# Altium schematic sheet dcdc_conv.SchDoc
size A
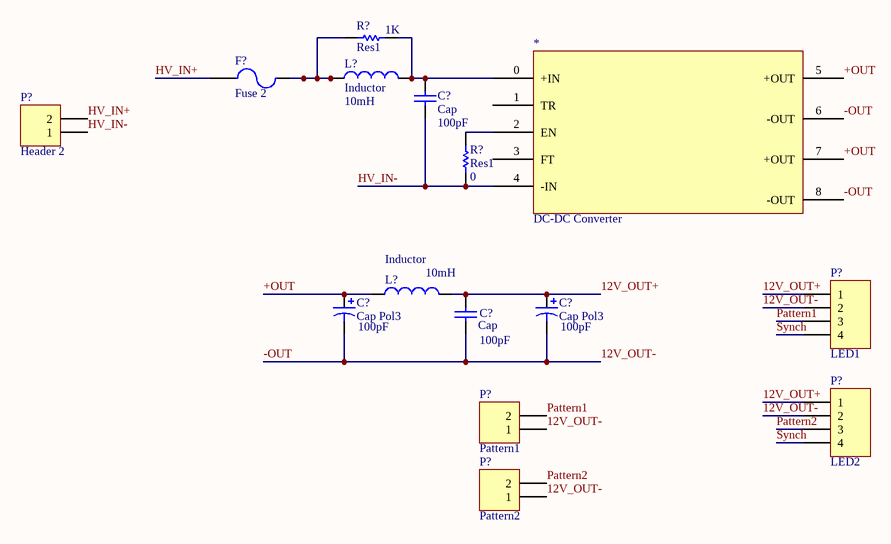
[diagram p0: dcdc_conv.SchDoc]

## Parts
(Parts that share a designator on the sheet are numbered #1, #2 ... from top to bottom, then left to right.)
*  DC-DC Converter
C?#1  Cap  value 100pF  [RAD-0.3]
C?#2  Cap Pol3  value 100pF  [C0805]
C?#3  Cap Pol3  value 100pF  [C0805]
C?#4  Cap  value 100pF  [RAD-0.3]
F?  Fuse 2  [PIN-W2/E2.8]
L?#1  Inductor  value 10mH  [0402-A]
L?#2  Inductor  value 10mH  [0402-A]
P?#1  Header 2  [HDR1X2]
P?#2  LED1  [HDR1X4]
P?#3  LED2  [HDR1X4]
P?#4  Pattern1  [HDR1X2]
P?#5  Pattern2  [HDR1X2]
R?#1  Res1  value 1K  [AXIAL-0.3]
R?#2  Res1  value 0  [AXIAL-0.3]

## Nets
12V_OUT+: C?#3.1 C?#4.2 L?#2.2 P?#2.1 P?#3.1
+OUT: *.5(+OUT) *.7(+OUT) C?#2.1 L?#2.1
-OUT: *.6(-OUT) *.8(-OUT) C?#2.2 C?#3.2 C?#4.1 P?#2.2 P?#3.2 P?#4.1 P?#5.1  [also labelled 12V_OUT-]
HV_IN+: F?.1 P?#1.2
HV_IN-: *.4(-IN) C?#1.1 P?#1.1 R?#2.1
Pattern1: P?#2.3 P?#4.2
Pattern2: P?#3.3 P?#5.2
Synch: P?#2.4 P?#3.4
Net*_0: *.0(+IN) C?#1.2 L?#1.2 R?#1.2
Net*_2: *.2(EN) R?#2.2
NetF?_2: F?.2 L?#1.1 R?#1.1

Not connected (* = marked no-connect by the designer): * 1(TR) 3(FT)

## Library data of the parts
C?#1 C?#4 = Cap: Capacitor; Published: 8-Jun-2000; LatestRevisionDate: 17-Jul-2002; LatestRevisionNote: Re-released for DXP Platform.; PackageReference: RAD-0.3; Publisher: Altium Limited; PackageDescription: Radial Cap, Thru-Hole; 2 Leads; 0.3 in Pin Spacing
C?#2 C?#3 = Cap Pol3: Polarized Capacitor (Surface Mount); Published: 8-Jun-2000; LatestRevisionDate: 29-May-2009; LatestRevisionNote: IPC-7351 Footprint Added.; PackageReference: C0805; Publisher: Altium Limited; PackageDescription: Chip Capacitor
F? = Fuse 2: Fuse; Published: 8-Jun-2000; LatestRevisionDate: 17-Jul-2002; LatestRevisionNote: Re-released for DXP Platform.; PackageReference: PIN-W2/E2.8; Publisher: Altium Limited; PackageDescription: Thru-Hole; 2 Leads
L?#1 L?#2 = Inductor: Code_IEC: 1005; Published: 8-Jun-2000; LatestRevisionDate: 29-May-2009; LatestRevisionNote: IPC-7351 Footprint Added.; PackageReference: 0402-A; Publisher: Altium Limited; PackageDescription: Chip Inductor; Code_JEITA: 0402
P?#1 P?#4 P?#5 = Header 2: Header, 2-Pin; LatestRevisionDate: 17-Jul-2002; LatestRevisionNote: Re-released for DXP Platform.; Publisher: Altium Limited
P?#2 P?#3 = Header 4: Header, 4-Pin; LatestRevisionDate: 17-Jul-2002; LatestRevisionNote: Re-released for DXP Platform.; Publisher: Altium Limited
R?#1 R?#2 = Res1: Resistor; Published: 8-Jun-2000; LatestRevisionDate: 17-Jul-2002; LatestRevisionNote: Re-released for DXP Platform.; PackageReference: AXIAL-0.3; Publisher: Altium Limited; PackageDescription: Axial Device, Thru-Hole; 2 Leads; 0.3 in Pin Spacing